# Altium schematic sheet Comm.SchDoc
size A4; SheetNumber: 2; SheetTotal: 2
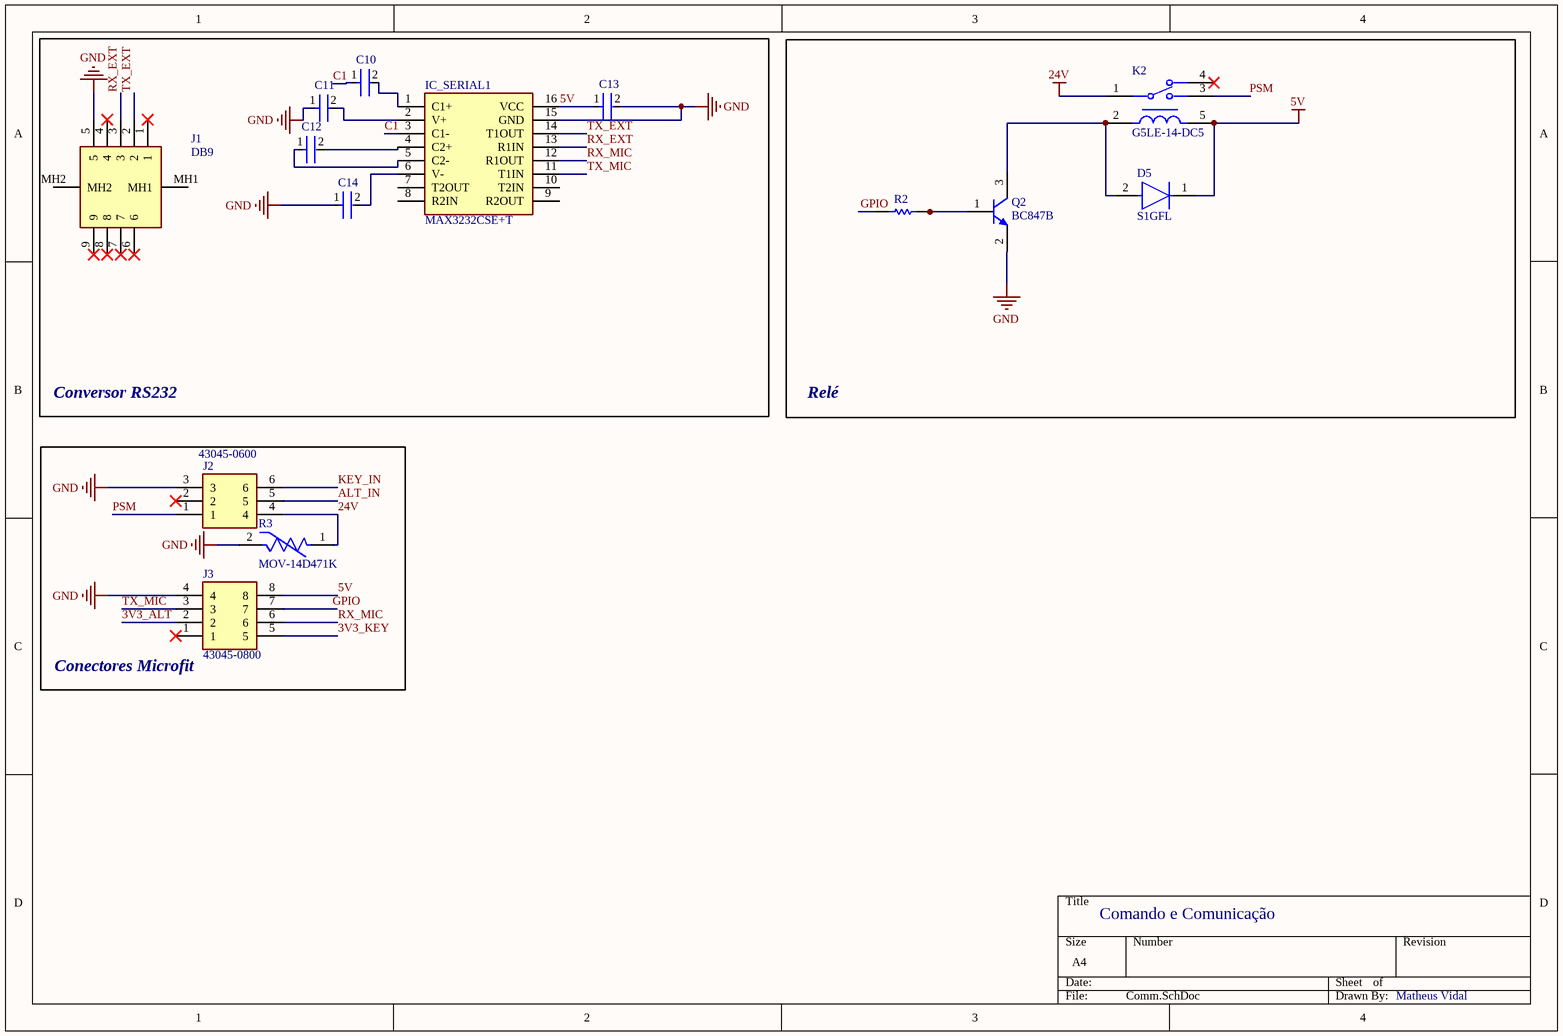
[diagram p0: Comm.SchDoc]

## Parts
C10  08055C104J4T2A  [FP-0805-L_2_01_0_2-W_1_25-MFG]  (value not drawn)
C11  08055C104J4T2A  [FP-0805-L_2_01_0_2-W_1_25-MFG]  (value not drawn)
C12  08055C104J4T2A  [FP-0805-L_2_01_0_2-W_1_25-MFG]  (value not drawn)
C13  08055C104J4T2A  [FP-0805-L_2_01_0_2-W_1_25-MFG]  (value not drawn)
C14  08055C104J4T2A  [FP-0805-L_2_01_0_2-W_1_25-MFG]  (value not drawn)
D5  S1GFL  [FP-425AD-MFG]
IC_SERIAL1  MAX3232CSE+T  [SOIC127P600X175-16N]
J1  DB9  [L77DFE09S1AMN]
J2  43045-0600  [43045-06(00,01,02,10)]
J3  43045-0800  [43045-08(00,01,02,10)]
K2  G5LE-14-DC5  [FP-G5LE-14-DC5-MFG]
Q2  BC847B  [INF-SOT23_M]
R2  10k  [RESC2013X50X30LL20T20]  (value not drawn)
R3  MOV-14D471K  [FP-MOV-14D471K-MFG]

## Blocks framed on the sheet
Conversor RS232: C10-C14 IC_SERIAL1 J1
Relé: D5 K2 Q2 R2
Conectores Microfit: J2 J3 R3

## Nets
5V: C13.1 D5.1(C) IC_SERIAL1.16(VCC) J3.8 K2.5
24V: J2.4 K2.1 R3.1
GND: C11.1 C13.2 C14.1 IC_SERIAL1.15(GND) J1.5 J2.3 J3.4 Q2.2(E) R3.2
3V3_ALT: J3.2
3V3_KEY: J3.5
ALT_IN: J2.5
C1: C10.1 IC_SERIAL1.3(C1-)
GPIO: J3.7 R2.2
KEY_IN: J2.6
PSM: J2.1 K2.3
RX_EXT: IC_SERIAL1.13(R1IN) J1.3
RX_MIC: IC_SERIAL1.12(R1OUT) J3.6
TX_EXT: IC_SERIAL1.14(T1OUT) J1.2
TX_MIC: IC_SERIAL1.11(T1IN) J3.3
NetC10_2: C10.2 IC_SERIAL1.1(C1+)
NetC11_2: C11.2 IC_SERIAL1.2(V+)
NetC12_1: C12.1 IC_SERIAL1.5(C2-)
NetC12_2: C12.2 IC_SERIAL1.4(C2+)
NetC14_2: C14.2 IC_SERIAL1.6(V-)
NetD5_2: D5.2(A) K2.2 Q2.3(C)
NetQ2_1: Q2.1(B) R2.1

Not connected (* = marked no-connect by the designer): IC_SERIAL1 7(T2OUT) 8(R2IN) 9(R2OUT) 10(T2IN); J1 1* 4* 6* 7* 8* 9* MH1 MH2; J2 2*; J3 1*; K2 4*

## Notes on the sheet
- Comando e Comunicação
- Matheus Vidal

## Library data of the parts
C10-C14 = CMP-2007-04725-2: Automotive Ceramic Capacitor, 0805, 100nF, 5%, X7R, 15%, 50V; Dissipation Factor: 2.5%; Construction: Flat; Length: 2.01mm; Series: -; Tolerance: 5%; Number of Pins: 2; Termination: SMD/SMT; Packaging: Tape and Reel; Case/Package: 0805; Mount: Surface Mount; Depth: 1.25mm; Voltage Rating (DC): 50V; Package Quantity: 4000; RoHS Compliant: Yes; Ratings: AEC-Q200; Voltage Rating: 50V; Contact Plating: Tin; Width: 0.049inch; Height: 0.94mm; Dielectric: X7R; Case Code (Metric): 2012; Min Operating Temperature: -55°C; Lead Free: Lead Free; Radiation Hardening: No; Capacitance: 100nF; Thickness: 0.037inch; Max Operating Temperature: 125°C; Case Code (Imperial): 0805
D5 = CMP-00278-84331274-1: S1GFL Rectifier Diode, 1 Phase, 1 Element, 1A, 400V V(RRM), Silicon; Manufacturer Lifecycle Status: ACTIVE, NOT REC; Reverse Recovery Time: 2µs; Peak Reverse Current: 1µA; Max Junction Temperature (Tj): 175°C; Capacitance: 4pF; Element Configuration: Single; Max Forward Surge Current (Ifsm): 30A; Mount: Surface Mount; Forward Current: 1A; Max Operating Temperature: 150°C; Schedule B: 8541100080, 8541100080; Max Repetitive Reverse Voltage (Vrrm): 400V; Reverse Voltage: 400V; Average Rectified Current: 1A; Lifecycle Status: NRND; RoHS: Compliant; Max Reverse Voltage (DC): 400V; Height: 1.08mm; NexarPartId: 84331274; Min Operating Temperature: -55°C; Weight: 27.6mg
IC_SERIAL1 = MAX3232CSE+T: Integrated Circuit; Manufacturer_Name: Analog Devices; Datasheet Link: https://datasheets.maximintegrated.com/en/ds/MAX3222-MAX3241.pdf; Height: 1.75mm; Manufacturer_Part_Number: MAX3232CSE+T; Mouser Part Number: 700-MAX3232CSET; Mouser Price/Stock: https://www.mouser.co.uk/ProductDetail/Analog-Devices-Maxim-Integrated/MAX3232CSE%2bT?qs=CDqwynd4ZNoTB%252BLjbeQ4Qg%3D%3D; Arrow Part Number: MAX3232CSE+T; Arrow Price/Stock: https://www.arrow.com/en/products/max3232cset/analog-devices?utm_currency=USD&region=nac
J1 = L77DFE09S1AMN: Connector; Manufacturer_Name: Amphenol Communications Solutions; Datasheet Link: https://cdn.amphenol-icc.com/media/wysiwyg/files/drawing/l77dfxxxs1amn.pdf; Height: 12.7mm; Manufacturer_Part_Number: L77DFE09S1AMN; Mouser Part Number: 523-L77DFE09S1AMN; Mouser Price/Stock: https://www.mouser.co.uk/ProductDetail/Amphenol-Commercial-Products/L77DFE09S1AMN?qs=mq7kV%2Fq8lk7eGEI8ax9brw%3D%3D
J2 = 43045-0600: Connector; Manufacturer_Name: Molex; Datasheet Link: https://www.molex.com/pdm_docs/sd/430450200_sd.pdf; Height: 9.9mm; Manufacturer_Part_Number: 43045-0600; Mouser Part Number: 538-43045-0600; Mouser Price/Stock: https://www.mouser.co.uk/ProductDetail/Molex/43045-0600?qs=mrPiglD9aYJ8CzJ%2FE2PNbw%3D%3D; Arrow Part Number: 43045-0600; Arrow Price/Stock: https://www.arrow.com/en/products/43045-0600/molex?region=nac
J3 = 43045-0800: Connector; Manufacturer_Name: Molex; Datasheet Link: https://www.molex.com/pdm_docs/sd/430450200_sd.pdf; Height: 8.77mm; Manufacturer_Part_Number: 43045-0800; Mouser Part Number: 538-43045-0800; Mouser Price/Stock: https://www.mouser.co.uk/ProductDetail/Molex/43045-0800?qs=MGlPTwjtJ4Z70Z3DbkGxKw%3D%3D
K2 = CMP-08822-000008-1: RELAY GEN PURPOSE SPDT 10A 5V; Manufacturer: Omron; Number Of Contacts: 1; Coil Type: Non-Latching; Coil Current: 79.4mA; Coil Power: 400mW; Description: General Purpose Relays Power PCB Relay SPDT Sealed 5VDC; Coil Resistance: 63Ω; Standoff Height: 0.5mm; Throw Configuration: SPDT; Ambient Temperature Range Low: -25°C; Package: 0; Device Class L2: Relays; Temperature Range High: +85°C; ComponentLink2Description: Datasheet; Octopart: https://octopart.com/g5le-14-dc5-omron-28829; Coil Voltage: 5V; Lead Free: Yes; Digikey Description: RELAY GEN PURPOSE SPDT 10A 5V; Device Class L1: Electromechanical; Device Class L3: Power Relays; ComponentLink2URL: https://omronfs.omron.com/en_US/ecb/products/pdf/en-g5le.pdf; Temperature: -25°C to +85°C; Ambient Temperature Range High: +85°C; RoHS: TRUE; Automotive: No; Height: 19mm; Category: Relay; Manufacturer Part Number: G5LE-14-DC5; Mouser Description: General Purpose Relays Power PCB Relay SPDT Sealed 5VDC; Current Rating: 10A; Switching Current: 10A; Temperature Range Low: -25°C
Q2 = CMP-1177-00042-1: NPN Silicon AF Transistor, 45 V VCEO, 100 mA IC, SOT23, Reel, Green; Manufacturer: Infineon; VEBO (max): 6Â V; ICBO (max): 15Â nA; VCBO (max): 50Â V; IBM (max): 200Â mA; Green: TRUE; Ptot (max): 330Â mW; fT (typ): 250Â MHz; IC (max): 100Â mA; VCEO (max): 45Â V; PackageDescription: 3-Pin Small Outline Transistor Package, 1.3 x 2.9 mm Body, 0.95 mm Pitch; ComponentLink3URL: http://www.infineon.com/dgdl/SOT23-Package_Overview.pdf?folderId=db3a30431936bc4b0119532290053c66&fileId=db3a30431936bc4b0119533468123c85; PackageVersion: Apr-08; Packing: Reel; ComponentLink3Description: Package Specification; ComponentLink2URL: http://www.infineon.com/dgdl/bc847series_bc848series_bc849series_bc850series.pdf?folderId=db3a304314dca389011541d30fa21656&fileId=db3a304314dca389011541d4630a1657; ComponentLink1URL: http://www.infineon.com/; ComponentLink2Description: Datasheet; Polarity: NPN; Mounting Technology: Surface Mount; PackageReference: SOT23; ICM (max): 200Â mA; ComponentLink1Description: Manufacturer URL; PartNumber: BC847B
R2 = CMP-2001-04896-1: Manufacturer: Vishay Dale; Part Number: CRCW08050000Z0EA
R3 = CMP-07402-000007-1: VARISTOR 470V 4.5KA DISC 14MM; Manufacturer: Bourns Inc.; Value: 516pF; Clamping Voltage: 775V; Esd Protec Present: true; Voltage Rating Ac: 300V; Clamping Current: 50A; Voltage Tolerance: 10%; Varistor Voltage: 423V; Voltage Rating Dc: 385V; Temperature Range High: +105°C; Device Class L3: unset; Category: Res; Package: Radial; Height: 20mm; Device Class L1: Circuit Protection; Temperature Range Low: -40°C; Lead Free: Yes; Automotive: No; Mouser Description: Varistors 470volts 14mm; RoHS: TRUE; Octopart: https://octopart.com/mov-14d471k-bourns-21388916; Device Class L2: Varistors; Manufacturer Part Number: MOV-14D471K; Digikey Description: VARISTOR 470V 4.5KA DISC 14MM; Temperature: -40°C to +105°C; Capacitance: 516pF; ComponentLink2Description: Datasheet; ComponentLink2URL: https://www.bourns.com/docs/product-datasheets/mov14d.pdf?sfvrsn=d6ed188_26